# Altium schematic sheet MainSch.SchDoc
size A4; SheetNumber: 1; SheetTotal: 2
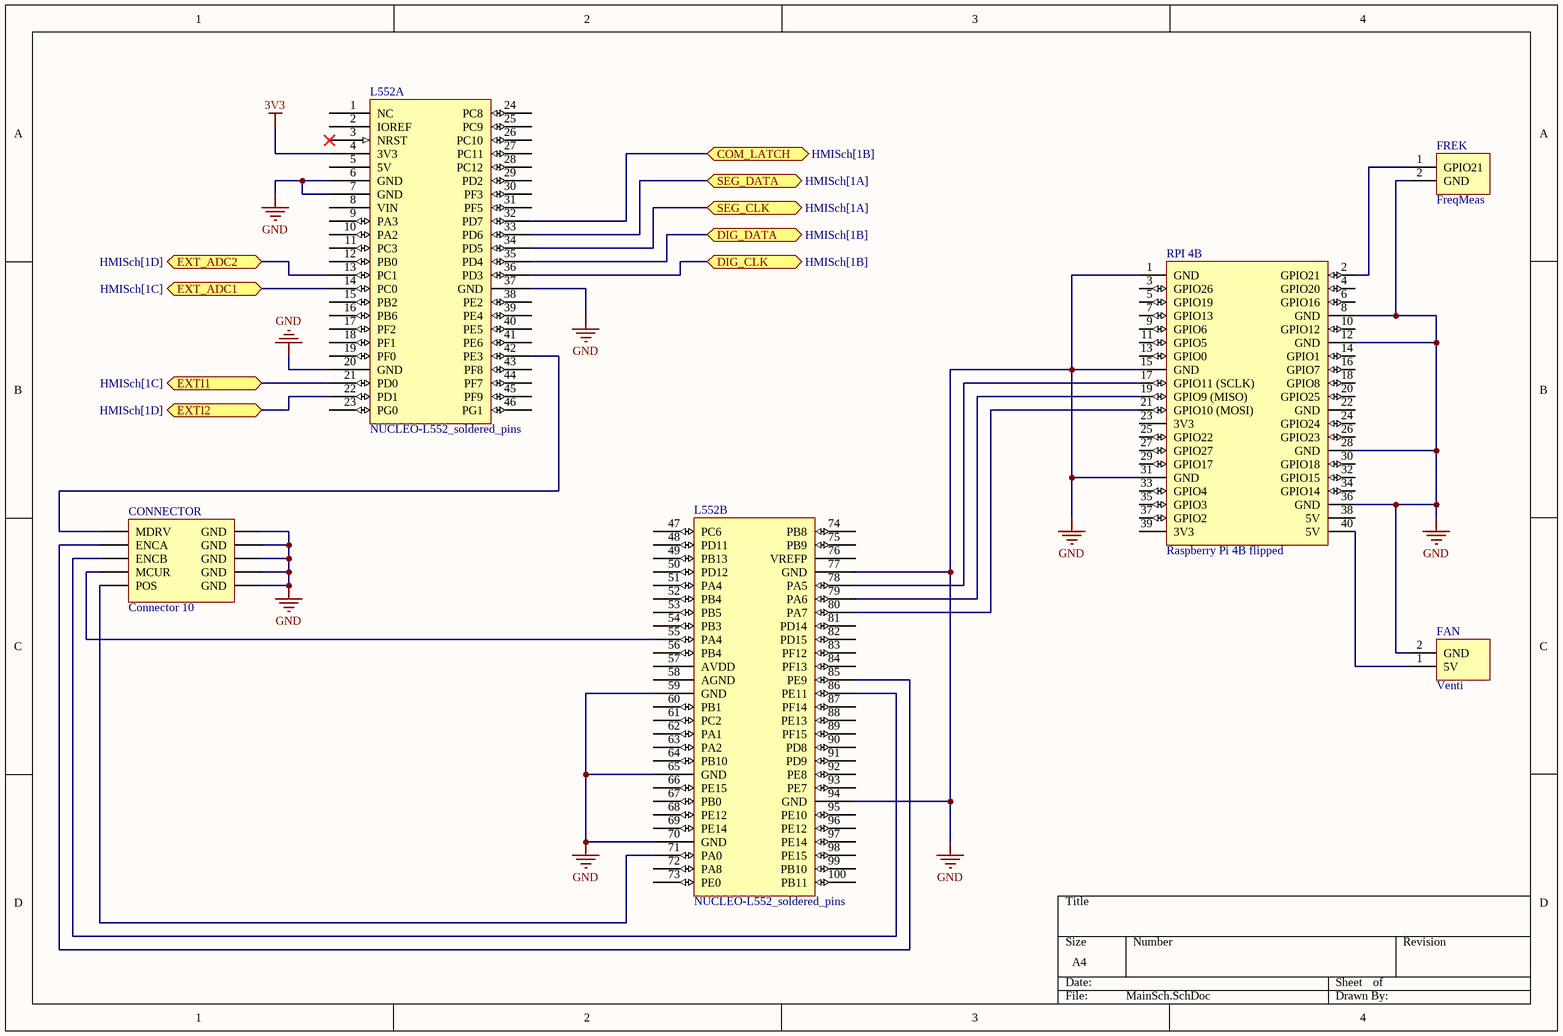
[diagram p0: MainSch.SchDoc]

## Parts
CONNECTOR  Connector 10  [CONNECTOR-10P]
FAN  Venti  [FP_CONN2_TUSKE_254MM]
FREK  FreqMeas  [FP_CONN2_TUSKE_254MM]
L552  NUCLEO-L552_soldered_pins  [FP_NUCLEO-144 inner connector]  (parts A,B of 2)
RPI_4B  Raspberry Pi 4B flipped  [Raspberry Pi 4B flipped]

## Ports
COM_LATCH (bidir, see HMISch[1B]), DIG_CLK (bidir, see HMISch[1B]), DIG_DATA (bidir, see HMISch[1B]), EXT_ADC1 (bidir, see HMISch[1C]), EXT_ADC2 (bidir, see HMISch[1D]), EXTI1 (bidir, see HMISch[1C]), EXTI2 (bidir, see HMISch[1D]), SEG_CLK (bidir, see HMISch[1A]), SEG_DATA (bidir, see HMISch[1A])

## Nets
3V3: L552.4(3V3)
GND: CONNECTOR.2(GND) CONNECTOR.4(GND) CONNECTOR.6(GND) CONNECTOR.8(GND) CONNECTOR.10(GND) FAN.2(GND) FREK.2(GND) L552.6(GND) L552.7(GND) L552.20(GND) L552.37(GND) L552.59(GND) L552.65(GND) L552.70(GND) L552.77(GND) L552.94(GND) RPI_4B.1(GND) RPI_4B.8(GND) RPI_4B.12(GND) RPI_4B.15(GND) RPI_4B.28(GND) RPI_4B.31(GND) RPI_4B.36(GND)
COM_LATCH: L552.32(PD7) ; port COM_LATCH
DIG_CLK: L552.36(PD3) ; port DIG_CLK
DIG_DATA: L552.35(PD4) ; port DIG_DATA
EXT_ADC1: L552.14(PC0) ; port EXT_ADC1
EXT_ADC2: L552.13(PC1) ; port EXT_ADC2
EXTI1: L552.21(PD0) ; port EXTI1
EXTI2: L552.22(PD1) ; port EXTI2
SEG_CLK: L552.34(PD5) ; port SEG_CLK
SEG_DATA: L552.33(PD6) ; port SEG_DATA
NetCONNECTOR_1: CONNECTOR.1(MDRV) L552.42(PE3)
NetCONNECTOR_3: CONNECTOR.3(ENCA) L552.85(PE9)
NetCONNECTOR_5: CONNECTOR.5(ENCB) L552.86(PE11)
NetCONNECTOR_7: CONNECTOR.7(MCUR) L552.55(PA4)
NetCONNECTOR_9: CONNECTOR.9(POS) L552.71(PA0)
NetFAN_1: FAN.1(5V) RPI_4B.40(5V)
NetFREK_1: FREK.1(GPIO21) RPI_4B.2(GPIO21)
NetL552_78: L552.78(PA5) RPI_4B.17(GPIO11_(SCLK))
NetL552_79: L552.79(PA6) RPI_4B.19(GPIO9_(MISO))
NetL552_80: L552.80(PA7) RPI_4B.21(GPIO10_(MOSI))

Not connected (* = marked no-connect by the designer): L552 1(NC) 2(IOREF) 3(NRST)* 5(5V) 8(VIN) 9(PA3) 10(PA2) 11(PC3) 12(PB0) 15(PB2) 16(PB6) 17(PF2) 18(PF1) 19(PF0) 23(PG0) 24(PC8) 25(PC9) 26(PC10) 27(PC11) 28(PC12) 29(PD2) 30(PF3) 31(PF5) 38(PE2) 39(PE4) 40(PE5) 41(PE6) 43(PF8) 44(PF7) 45(PF9) 46(PG1) 47(PC6) 48(PD11) 49(PB13) 50(PD12) 51(PA4) 52(PB4) 53(PB5) 54(PB3) 56(PB4) 57(AVDD) 58(AGND) 60(PB1) 61(PC2) 62(PA1) 63(PA2) 64(PB10) 66(PE15) 67(PB0) 68(PE12) 69(PE14) 72(PA8) 73(PE0) 74(PB8) 75(PB9) 76(VREFP) 81(PD14) 82(PD15) 83(PF12) 84(PF13) 87(PF14) 88(PE13) 89(PF15) 90(PD8) 91(PD9) 92(PE8) 93(PE7) 95(PE10) 96(PE12) 97(PE14) 98(PE15) 99(PB10) 100(PB11); RPI_4B 3(GPIO26) 4(GPIO20) 5(GPIO19) 6(GPIO16) 7(GPIO13) 9(GPIO6) 10(GPIO12) 11(GPIO5) 13(GPIO0) 14(GPIO1) 16(GPIO7) 18(GPIO8) 20(GPIO25) 22(GND) 23(3V3) 24(GPIO24) 25(GPIO22) 26(GPIO23) 27(GPIO27) 29(GPIO17) 30(GPIO18) 32(GPIO15) 33(GPIO4) 34(GPIO14) 35(GPIO3) 37(GPIO2) 38(5V) 39(3V3)

## Library data of the parts
CONNECTOR = Connector 10 spec: Special 10 pin ribbon connector; Reference: *; Supplier: *; Name: *
FAN FREK = Connector_2pin: 2pin connector
L552 = NUCLEO-L552_inner: https://www.st.com/resource/en/user_manual/um2581-stm32l5-nucleo144-board-mb1361-stmicroelectronics.pdf